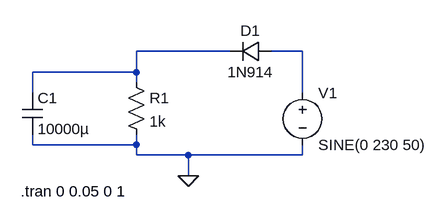
[diagram p0: schematic Half wave rectifiert with filter.asc]
Half wave rectifiert with filter.asc, the LTspice schematic file:
Version 4
SHEET 1 880 680
WIRE 256 64 112 64
WIRE 368 64 320 64
WIRE 112 96 112 64
WIRE 112 96 -48 96
WIRE 112 112 112 96
WIRE -48 128 -48 96
WIRE 368 128 368 64
WIRE -48 208 -48 192
WIRE 112 208 112 192
WIRE 112 208 -48 208
WIRE 112 224 112 208
WIRE 192 224 112 224
WIRE 368 224 368 208
WIRE 368 224 192 224
WIRE 192 256 192 224
FLAG 192 256 0
SYMBOL voltage 368 112 R0
WINDOW 123 0 0 Left 0
WINDOW 39 0 0 Left 0
SYMATTR InstName V1
SYMATTR Value SINE(0 230 50)
SYMBOL res 96 96 R0
SYMATTR InstName R1
SYMATTR Value 1k
SYMBOL diode 320 48 R90
WINDOW 0 0 32 VBottom 2
WINDOW 3 32 32 VTop 2
SYMATTR InstName D1
SYMATTR Value 1N914
SYMBOL cap -64 128 R0
SYMATTR InstName C1
SYMATTR Value 10000µ
TEXT -66 280 Left 2 !.tran 0 0.05 0 1

The netlist it stands for:
* Half wave rectifiert with filter.asc
V1 N002 0 SINE(0 230 50)
R1 N001 0 1k
D1 N002 N001 1N914
C1 N001 0 10000µ
.model D D
.lib standard.dio
.tran 0 0.05 0 1
.backanno
.end